# Altium schematic sheet MPU6881_Schematic.SchDoc
size A
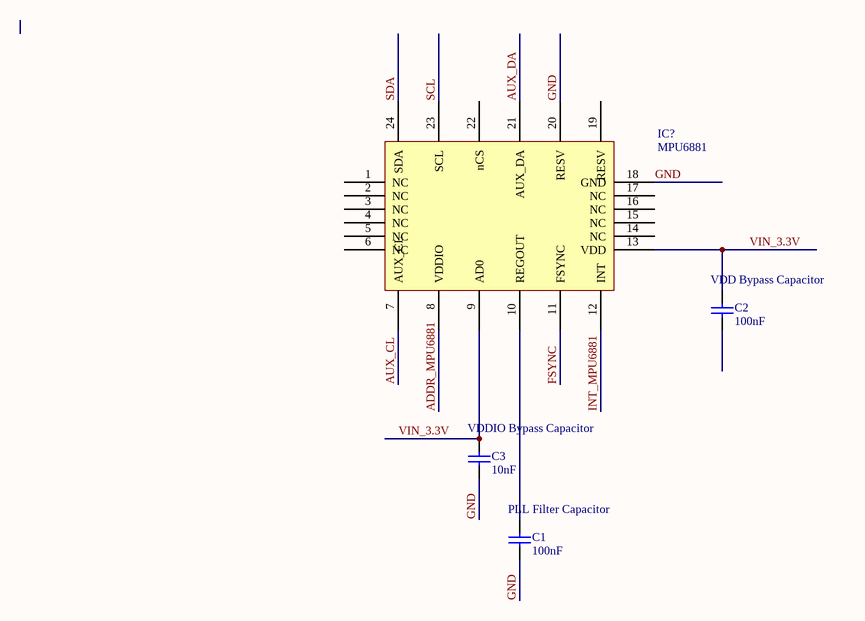
[diagram p0: MPU6881_Schematic.SchDoc]

## Parts
C1  PLL Filter Capacitor  value 100nF
C2  VDD Bypass Capacitor  value 100nF
C3  VDDIO Bypass Capacitor  VDDIO Bypass Capacitor: 10nF
IC?  MPU6881

## Nets
ADDR_MPU6881: IC?.8(VDDIO)
AUX_CL: IC?.7(AUX_CL)
AUX_DA: IC?.21(AUX_DA)
FSYNC: IC?.11(FSYNC)
GND: C1.1 C3.1 IC?.18(GND) IC?.20(RESV)
INT_MPU6881: IC?.12(INT)
SCL: IC?.23(SCL)
SDA: IC?.24(SDA)
VIN_3.3V: C2.2 C3.2 IC?.9(AD0) IC?.13(VDD)
NetC1_2: C1.2 IC?.10(REGOUT)

Not connected (* = marked no-connect by the designer): C2 1; IC? 1(NC) 2(NC) 3(NC) 4(NC) 5(NC) 6(NC) 14(NC) 15(NC) 16(NC) 17(NC) 19(RESV) 22(nCS)

## Library data of the parts
C1-C3 = Capacitor: SimulationGenericComponent: True